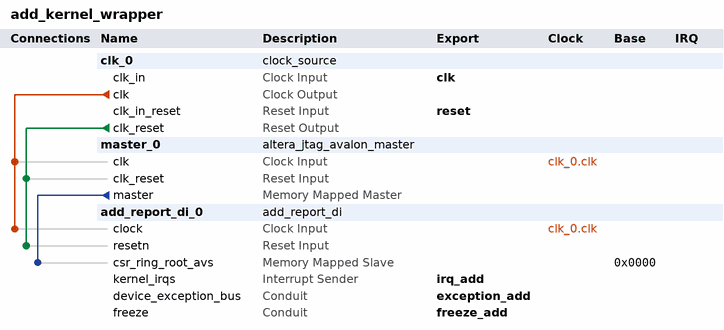
[diagram p0: system contents]
# Platform Designer (Qsys) system add_kernel_wrapper, Cyclone V 5CSEMA5F31C6
# Parameters at their usual value, and those the tool derives, are not listed.
package require -exact qsys 24.1
create_system add_kernel_wrapper
set_project_property DEVICE_FAMILY {Cyclone V}
set_project_property DEVICE 5CSEMA5F31C6

add_instance clk_0 clock_source 24.1
set_instance_parameter_value clk_0 clockFrequency 50000000

add_instance master_0 altera_jtag_avalon_master 24.1

add_instance add_report_di_0 add_report_di 1.0

# connections
add_connection clk_0.clk add_report_di_0.clock clock
add_connection clk_0.clk master_0.clk clock
add_connection clk_0.clk_reset add_report_di_0.resetn reset
add_connection clk_0.clk_reset master_0.clk_reset reset
add_connection master_0.master add_report_di_0.csr_ring_root_avs avalon
set_connection_parameter_value master_0.master/add_report_di_0.csr_ring_root_avs baseAddress 0x0000

# exported interfaces
add_interface clk clock sink
set_interface_property clk EXPORT_OF clk_0.clk_in
add_interface exception_add conduit end
set_interface_property exception_add EXPORT_OF add_report_di_0.device_exception_bus
add_interface freeze_add conduit end
set_interface_property freeze_add EXPORT_OF add_report_di_0.freeze
add_interface irq_add interrupt sender
set_interface_property irq_add EXPORT_OF add_report_di_0.kernel_irqs
add_interface reset reset sink
set_interface_property reset EXPORT_OF clk_0.clk_in_reset

set_interconnect_requirement {$system} qsys_mm.clockCrossingAdapter HANDSHAKE
set_interconnect_requirement {$system} qsys_mm.enableEccProtection FALSE
set_interconnect_requirement {$system} qsys_mm.insertDefaultSlave FALSE
set_interconnect_requirement {$system} qsys_mm.maxAdditionalLatency 1

save_system add_kernel_wrapper.qsys
